# EAGLE schematic tutorial1 (EAGLE 9.6.2)
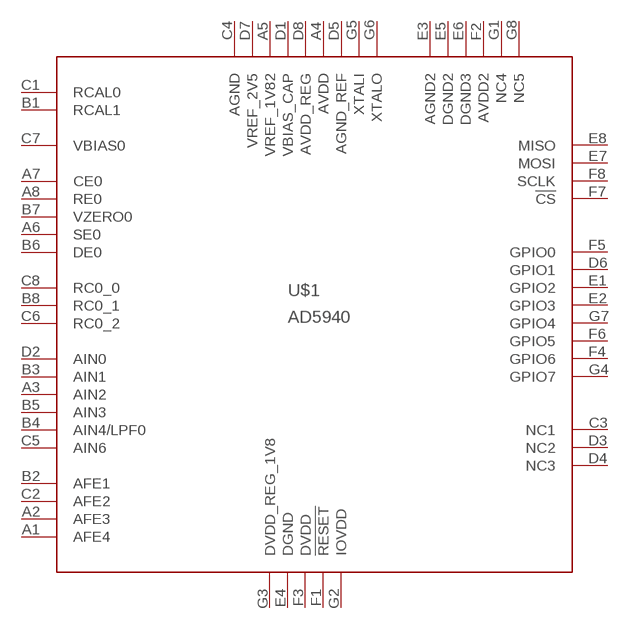
[diagram p0: schematic, sheet 1]

## Parts
U$1  AD5940  [WLCSP56]
Unconnected: U$1.A1(AFE4) U$1.A2(AFE3) U$1.A3(AIN2) U$1.A6(SE0) U$1.A7(CE0) U$1.A8(RE0) U$1.B1(RCAL1) U$1.B2(AFE1) U$1.B3(AIN1) U$1.B4(AIN4/LPF0) U$1.B5(AIN3) U$1.B6(DE0) U$1.B7(VZERO0) U$1.B8(RC0_1) U$1.C1(RCAL0) U$1.C2(AFE2) U$1.C3(NC1) U$1.C5(AIN6) U$1.C6(RC0_2) U$1.C7(VBIAS0) U$1.C8(RC0_0) U$1.D2(AIN0) U$1.D3(NC2) U$1.D4(NC3) U$1.D6(GPIO1) U$1.E1(GPIO2) U$1.E2(GPIO3) U$1.E7(MOSI) U$1.E8(MISO) U$1.F1(!RESET) U$1.F4(GPIO6) U$1.F5(GPIO0) U$1.F6(GPIO5) U$1.F7(!CS) U$1.F8(SCLK) U$1.G1(NC4) U$1.G4(GPIO7) U$1.G5(XTALI) U$1.G6(XTALO) U$1.G7(GPIO4) U$1.G8(NC5)

## Power pins joined to a net without a drawn wire
AGND: U$1.C4(AGND)
AGND2: U$1.E3(AGND2)
AGND_REF: U$1.D5(AGND_REF)
AVDD: U$1.A4(AVDD)
AVDD2: U$1.F2(AVDD2)
AVDD_REG: U$1.D8(AVDD_REG)
DGND: U$1.E4(DGND)
DGND2: U$1.E5(DGND2)
DGND3: U$1.E6(DGND3)
DVDD: U$1.F3(DVDD)
DVDD_REG_1V8: U$1.G3(DVDD_REG_1V8)
IOVDD: U$1.G2(IOVDD)
VBIAS_CAP: U$1.D1(VBIAS_CAP)
VREF_1V82: U$1.A5(VREF_1V82)
VREF_2V5: U$1.D7(VREF_2V5)

## Library data of the parts
U$1 = ad5940:AD5940: AD5940 High Precision, Impedance, and Electrochemical Front End https://wiki.analog.com/resources/eval/user-guides/ad5940